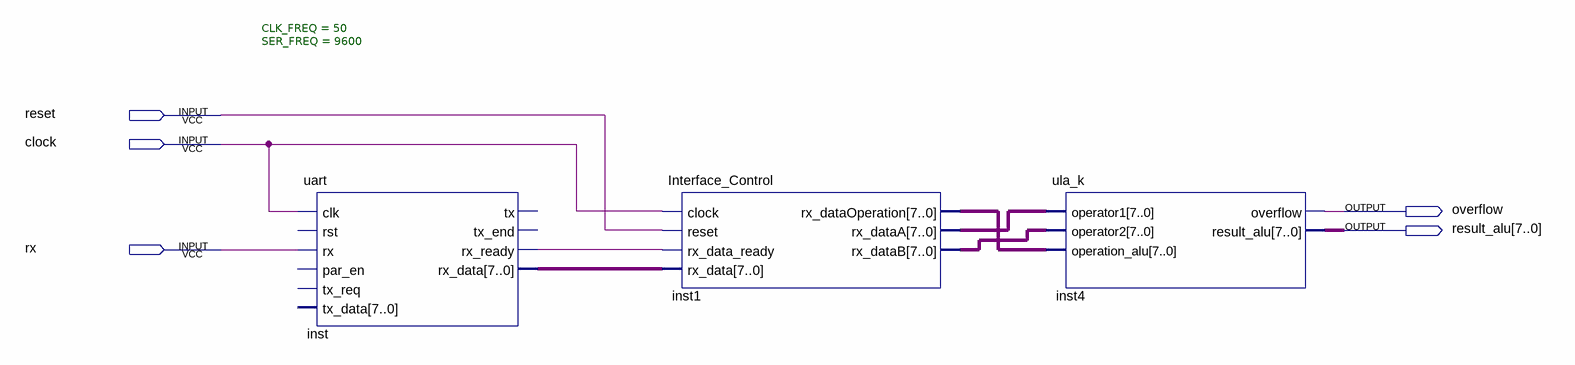
[diagram p0: schematic sheet]
// Quartus schematic hu3.bdf as structural Verilog: 3 symbols, 5 pins
module hu3 (
  input  reset,
  input  clock,
  input  rx,
  output overflow,
  output [7:0] result_alu
);

  wire inst_rx_ready;
  wire [7:0] inst1_rx_dataa, inst1_rx_datab, inst1_rx_dataoperation, inst_rx_data;

  uart #(.CLK_FREQ(50), .SER_FREQ(9600)) inst (
    .clk(clock), .rx(rx), .rx_ready(inst_rx_ready), .rx_data(inst_rx_data));  // open: rst, par_en, tx_req, tx_data, tx, tx_end
  Interface_Control inst1 (
    .clock(clock), .reset(reset), .rx_data_ready(inst_rx_ready), .rx_data(inst_rx_data),
    .rx_dataOperation(inst1_rx_dataoperation), .rx_dataA(inst1_rx_dataa), .rx_dataB(inst1_rx_datab));
  ula_k inst4 (
    .operator1(inst1_rx_dataa), .operator2(inst1_rx_datab), .operation_alu(inst1_rx_dataoperation),
    .overflow(overflow), .result_alu(result_alu));
endmodule
